# EAGLE design sdx-brkout (EAGLE 9.0.1)
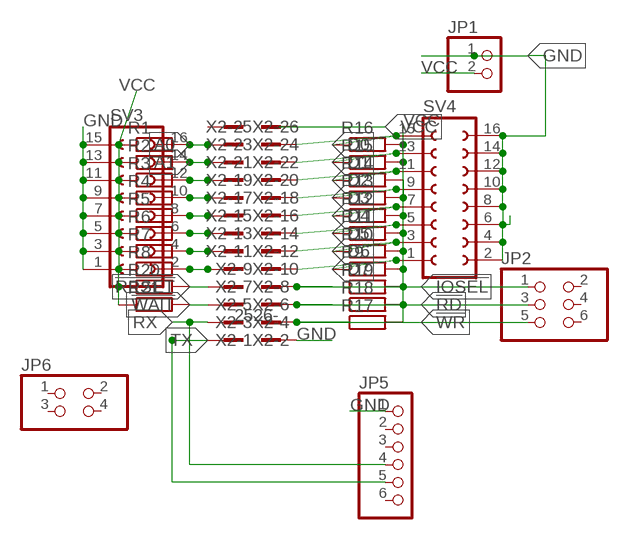
[diagram p0: schematic, sheet 1]

## Parts
JP1  PINHD-1X2  [1X02]
JP2  PINHD-2X3  [2X03]
JP5  PINHD-1X6/90  [1X06/90]
JP6  PINHD-2X2  [2X02]
R1  R-EU_R1206W  [R1206W]
R2  R-EU_R1206W  [R1206W]
R3  R-EU_R1206W  [R1206W]
R4  R-EU_R1206W  [R1206W]
R5  R-EU_R1206W  [R1206W]
R6  R-EU_R1206W  [R1206W]
R7  R-EU_R1206W  [R1206W]
R8  R-EU_R1206W  [R1206W]
R9  R-EU_R1206W  [R1206W]
R10  R-EU_R1206W  [R1206W]
R11  R-EU_R1206W  [R1206W]
R12  R-EU_R1206W  [R1206W]
R13  R-EU_R1206W  [R1206W]
R14  R-EU_R1206W  [R1206W]
R15  R-EU_R1206W  [R1206W]
R16  R-EU_R1206W  [R1206W]
R17  R-EU_R1206W  [R1206W]
R18  R-EU_R1206W  [R1206W]
R19  R-EU_R1206W  [R1206W]
R20  R-EU_R1206W  [R1206W]
R21  R-EU_R1206W  [R1206W]
SV3  FE08-2  [FE08-2]
SV4  FE08-2  [FE08-2]
X2  2526-  [PAK100/2500-26]

## Nets
!IOSEL: JP2.1 R19.1 X2.7
!RD: JP2.3 R18.1 X2.5
!RESET: R20.2 X2.8
!WAIT: R21.2 X2.6
!WR: JP2.5 R17.1 X2.3
A0: R1.2 SV3.16 X2.24
A1: R2.2 SV3.14 X2.22
D0: R16.1 SV4.15 X2.23
D1: R15.1 SV4.13 X2.21
D2: R14.1 SV4.11 X2.19
D3: R13.1 SV4.9 X2.17
D4: R12.1 SV4.7 X2.15
D5: R11.1 SV4.5 X2.13
D6: R10.1 SV4.3 X2.11
D7: R9.1 SV4.1 X2.9
GND: JP1.1 JP5.1 SV3.1 SV3.3 SV3.5 SV3.7 SV3.9 SV3.11 SV3.13 SV3.15 SV4.2 SV4.4 SV4.6 SV4.8 SV4.10 SV4.12 SV4.14 SV4.16 X2.1
N$1: R3.2 SV3.12 X2.20
N$2: R4.2 SV3.10 X2.18
N$3: R5.2 SV3.8 X2.16
N$4: R6.2 SV3.6 X2.14
N$5: R7.2 SV3.4 X2.12
N$6: R8.2 SV3.2 X2.10
RX: JP5.4 X2.4
TX: JP5.5 X2.2
VCC: JP1.2 R1.1 R2.1 R3.1 R4.1 R5.1 R6.1 R7.1 R8.1 R9.2 R10.2 R11.2 R12.2 R13.2 R14.2 R15.2 R16.2 R17.2 R18.2 R19.2 R20.1 R21.1
Unconnected: JP2.2 JP2.4 JP2.6 JP5.2 JP5.3 JP5.6 JP6.1 JP6.2 JP6.3 JP6.4 X2.25 X2.26

## Library data of the parts
JP1 = pinhead:PINHD-1X2: PIN HEADER
JP2 = pinhead:PINHD-2X3: PIN HEADER
JP5 = pinhead:PINHD-1X6: PIN HEADER
JP6 = pinhead:PINHD-2X2: PIN HEADER
R1-R21 = resistor:R-EU_: RESISTOR, European symbol
SV3 SV4 = con-lsta:FE08-2: FEMALE HEADER; OC_FARNELL: unknown; OC_NEWARK: unknown
X2 = con-3m:2526-: 3M (TM) Pak 100 4-Wall Header Source: 3M; OC_FARNELL: unknown; OC_NEWARK: unknown

## Board
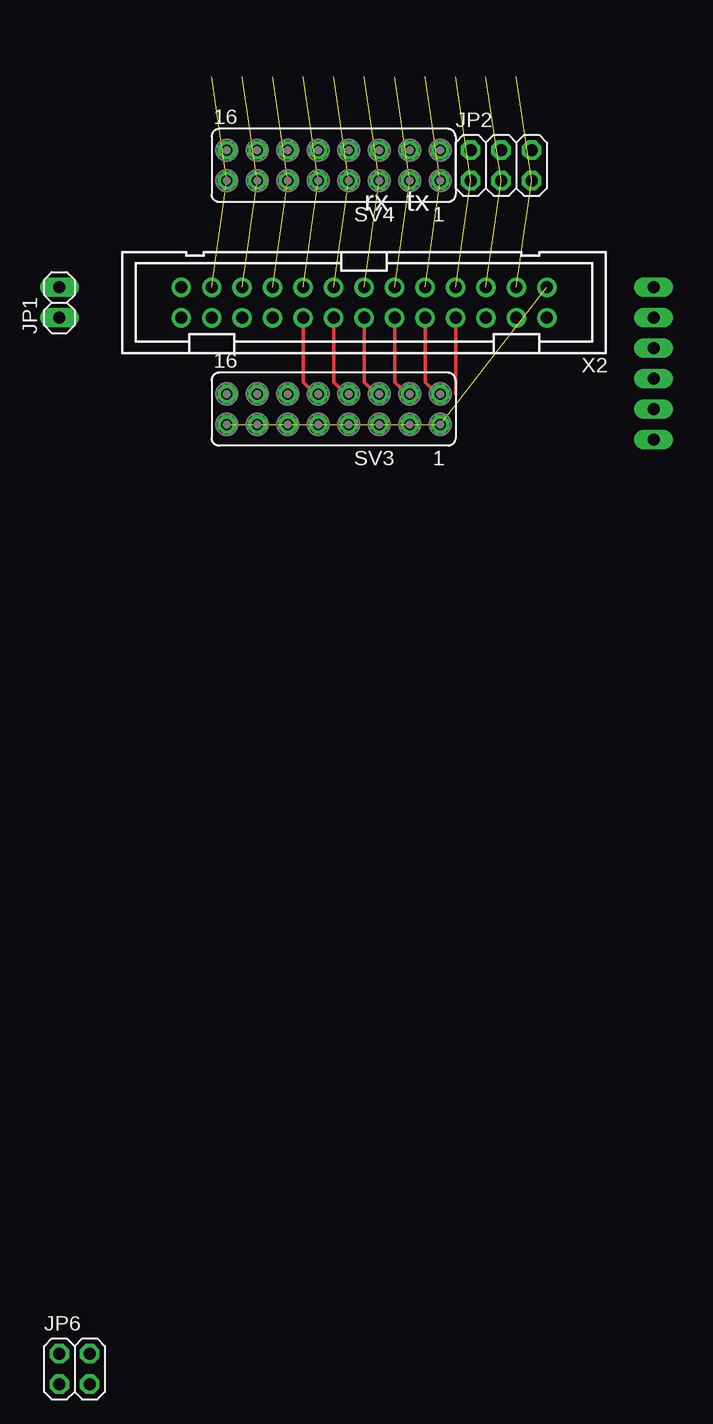
[diagram p1: board, top side]
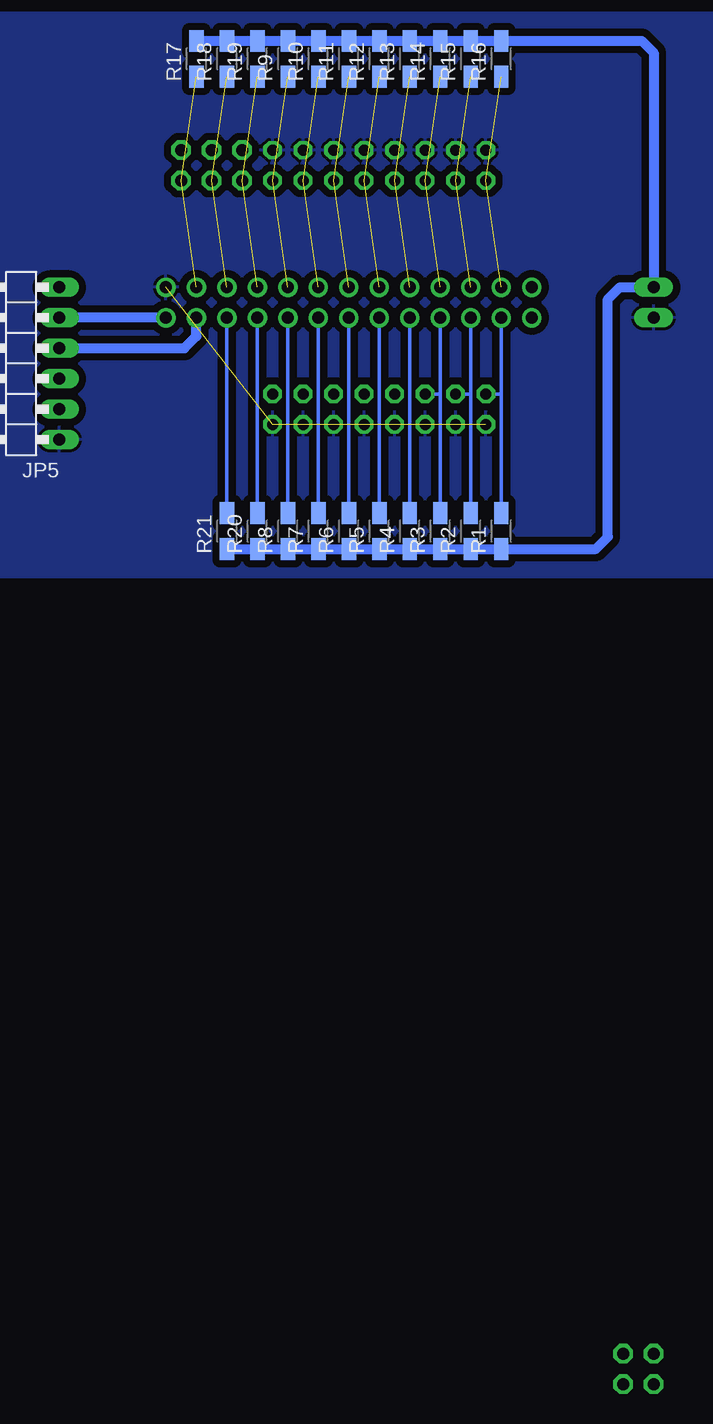
[diagram p2: board, bottom side, seen from below]

No outline drawn. Coordinates in mm, seen from the top.
Copper layers (1*16): Top 0.035mm / dielectric 1.5mm / Bottom 0.035mm
Design rules "SparkFun": minimum track width 8mil, minimum drill 20mil, track to track 8mil, track to pad 8mil, pad to pad 8mil, via to via 8mil, smd to smd 8mil, copper to edge 10mil, drill to drill 8mil, minimum pad ring 12mil, minimum via ring 10mil, stop-mask expansion 4mil, vias tented up to drill 25mil, thermal gap 10mil

### Footprints (pad centres in the part's own frame; a part is rotated, then mirrored left to right if it is on the bottom)
1X02 = drill 1.016 long: 1 -1.27,0; 2 1.27,0
2X03 = drill 1.016 octagon: 1 -2.54,-1.27; 2 -2.54,1.27; 3 0,-1.27; 4 0,1.27; 5 2.54,-1.27; 6 2.54,1.27
1X06/90 = drill 1.016 long: 1 -6.35,-3.81; 2 -3.81,-3.81; 3 -1.27,-3.81; 4 1.27,-3.81; 5 3.81,-3.81; 6 6.35,-3.81
2X02 = drill 1.016 octagon: 1 -1.27,-1.27; 2 -1.27,1.27; 3 1.27,-1.27; 4 1.27,1.27
R1206W = smd 1.8 x 1.2: 1 -1.499,0; 2 1.499,0
FE08-2 = drill 0.914 octagon: 1 -8.89,1.27; 2 -8.89,-1.27; 3 -6.35,1.27; 4 -6.35,-1.27; 5 -3.81,1.27; 6 -3.81,-1.27; 7 -1.27,1.27; 8 -1.27,-1.27; 9 1.27,1.27; 10 1.27,-1.27; 11 3.81,1.27; 12 3.81,-1.27; 13 6.35,1.27; 14 6.35,-1.27; 15 8.89,1.27; 16 8.89,-1.27
PAK100/2500-26 = drill 1 pad 1.422: 1 -15.24,-1.27; 2 -15.24,1.27; 3 -12.7,-1.27; 4 -12.7,1.27; 5 -10.16,-1.27; 6 -10.16,1.27; 7 -7.62,-1.27; 8 -7.62,1.27; 9 -5.08,-1.27; 10 -5.08,1.27; 11 -2.54,-1.27; 12 -2.54,1.27; 13 0,-1.27; 14 0,1.27; 15 2.54,-1.27; 16 2.54,1.27; 17 5.08,-1.27; 18 5.08,1.27; 19 7.62,-1.27; 20 7.62,1.27; 21 10.16,-1.27; 22 10.16,1.27; 23 12.7,-1.27; 24 12.7,1.27; 25 15.24,-1.27; 26 15.24,1.27

### Placement (x,y rotation side)
JP1  20.32,39.37 90 top
JP2  57.15,50.8 0 top
JP5  73.66,34.29 90 bottom
JP6  21.59,-49.53 0 top
R1  33.02,20.32 90 bottom
R2  35.56,20.32 90 bottom
R3  38.1,20.32 90 bottom
R4  40.64,20.32 90 bottom
R5  43.18,20.32 90 bottom
R6  45.72,20.32 90 bottom
R7  48.26,20.32 90 bottom
R8  50.8,20.32 90 bottom
R9  50.8,59.69 90 bottom
R10  48.26,59.69 90 bottom
R11  45.72,59.69 90 bottom
R12  43.18,59.69 90 bottom
R13  40.64,59.69 90 bottom
R14  38.1,59.69 90 bottom
R15  35.56,59.69 90 bottom
R16  33.02,59.69 90 bottom
R17  58.42,59.69 90 bottom
R18  55.88,59.69 90 bottom
R19  53.34,59.69 90 bottom
R20  53.34,20.32 90 bottom
R21  55.88,20.32 90 bottom
SV3  43.18,30.48 180 top
SV4  43.18,50.8 180 top
X2  45.72,39.37 180 top

### Tracks (layer width: path | path; a pad name or v marks a point on that pad's centre or on a via)
!IOSEL  (2 unrouted)
!RD  (2 unrouted)
!RESET
  Top 0.305: X2.8 53.34,31.75
  Bottom 0.305: R20.2 X2.8
!WAIT
  Bottom 0.305: R21.2 X2.6
!WR  (2 unrouted)
A0
  Bottom 0.305: X2.24 33.02,31.75 | 33.02,31.75 R1.2 | SV3.16 33.02,31.75
A1
  Bottom 0.305: X2.22 35.56,31.75 | 35.56,31.75 R2.2 | SV3.14 35.56,31.75
D0  (2 unrouted)
D1  (2 unrouted)
D2  (2 unrouted)
D3  (2 unrouted)
D4  (2 unrouted)
D5  (2 unrouted)
D6  (2 unrouted)
D7  (2 unrouted)
GND  (8 unrouted)
  pour Bottom (isolate 0.61): 15.24,63.5 74.93,63.5 74.93,16.51 15.24,16.51
N$1
  Bottom 0.305: X2.20 38.1,31.75 | 38.1,31.75 R3.2 | SV3.12 38.1,31.75
N$2
  Top 0.305: X2.18 40.64,32.75 41.64,31.75 SV3.10
  Bottom 0.305: R4.2 X2.18
N$3
  Top 0.305: X2.16 43.18,32.75 44.18,31.75 SV3.8
  Bottom 0.305: X2.16 R5.2
N$4
  Top 0.305: X2.14 45.72,32.75 46.72,31.75 SV3.6
  Bottom 0.305: X2.14 R6.2
N$5
  Top 0.305: X2.12 48.26,32.75 49.26,31.75 SV3.4
  Bottom 0.305: X2.12 R7.2
N$6
  Top 0.305: X2.10 50.8,32.75 51.8,31.75 SV3.2
  Bottom 0.305: X2.10 R8.2
RX
  Bottom 0.813: JP5.4 59.42,35.56 58.42,36.56 X2.4
TX
  Bottom 0.813: X2.2 JP5.5
VCC
  Bottom 0.813: R17.2 R18.2 R19.2 R9.2 R10.2 R11.2 R12.2 R13.2 R14.2 R15.2 R16.2 21.32,61.19 20.32,60.19 JP1.2 23.13,40.64 24.13,39.64 24.13,19.82 25.13,18.82 R1.1 R2.1 R3.1 R4.1 R5.1 R6.1 R7.1 R8.1 R20.1 R21.1

### Text on the board
tNames: M | rx tx